# Altium project LimeKEY-RPCM_1v2.PrjPcb (part 8 of 8)

## Sheet 13_Temp.SchDoc: Power
size A3; Organization: Lime Microsystems; Address1: Surrey Tech Centre; Address2: Guildford GU2 7YG; Address3: Surrey; Address4: United Kingdom; Revision: v1.1; SheetNumber: 12; SheetTotal: 12
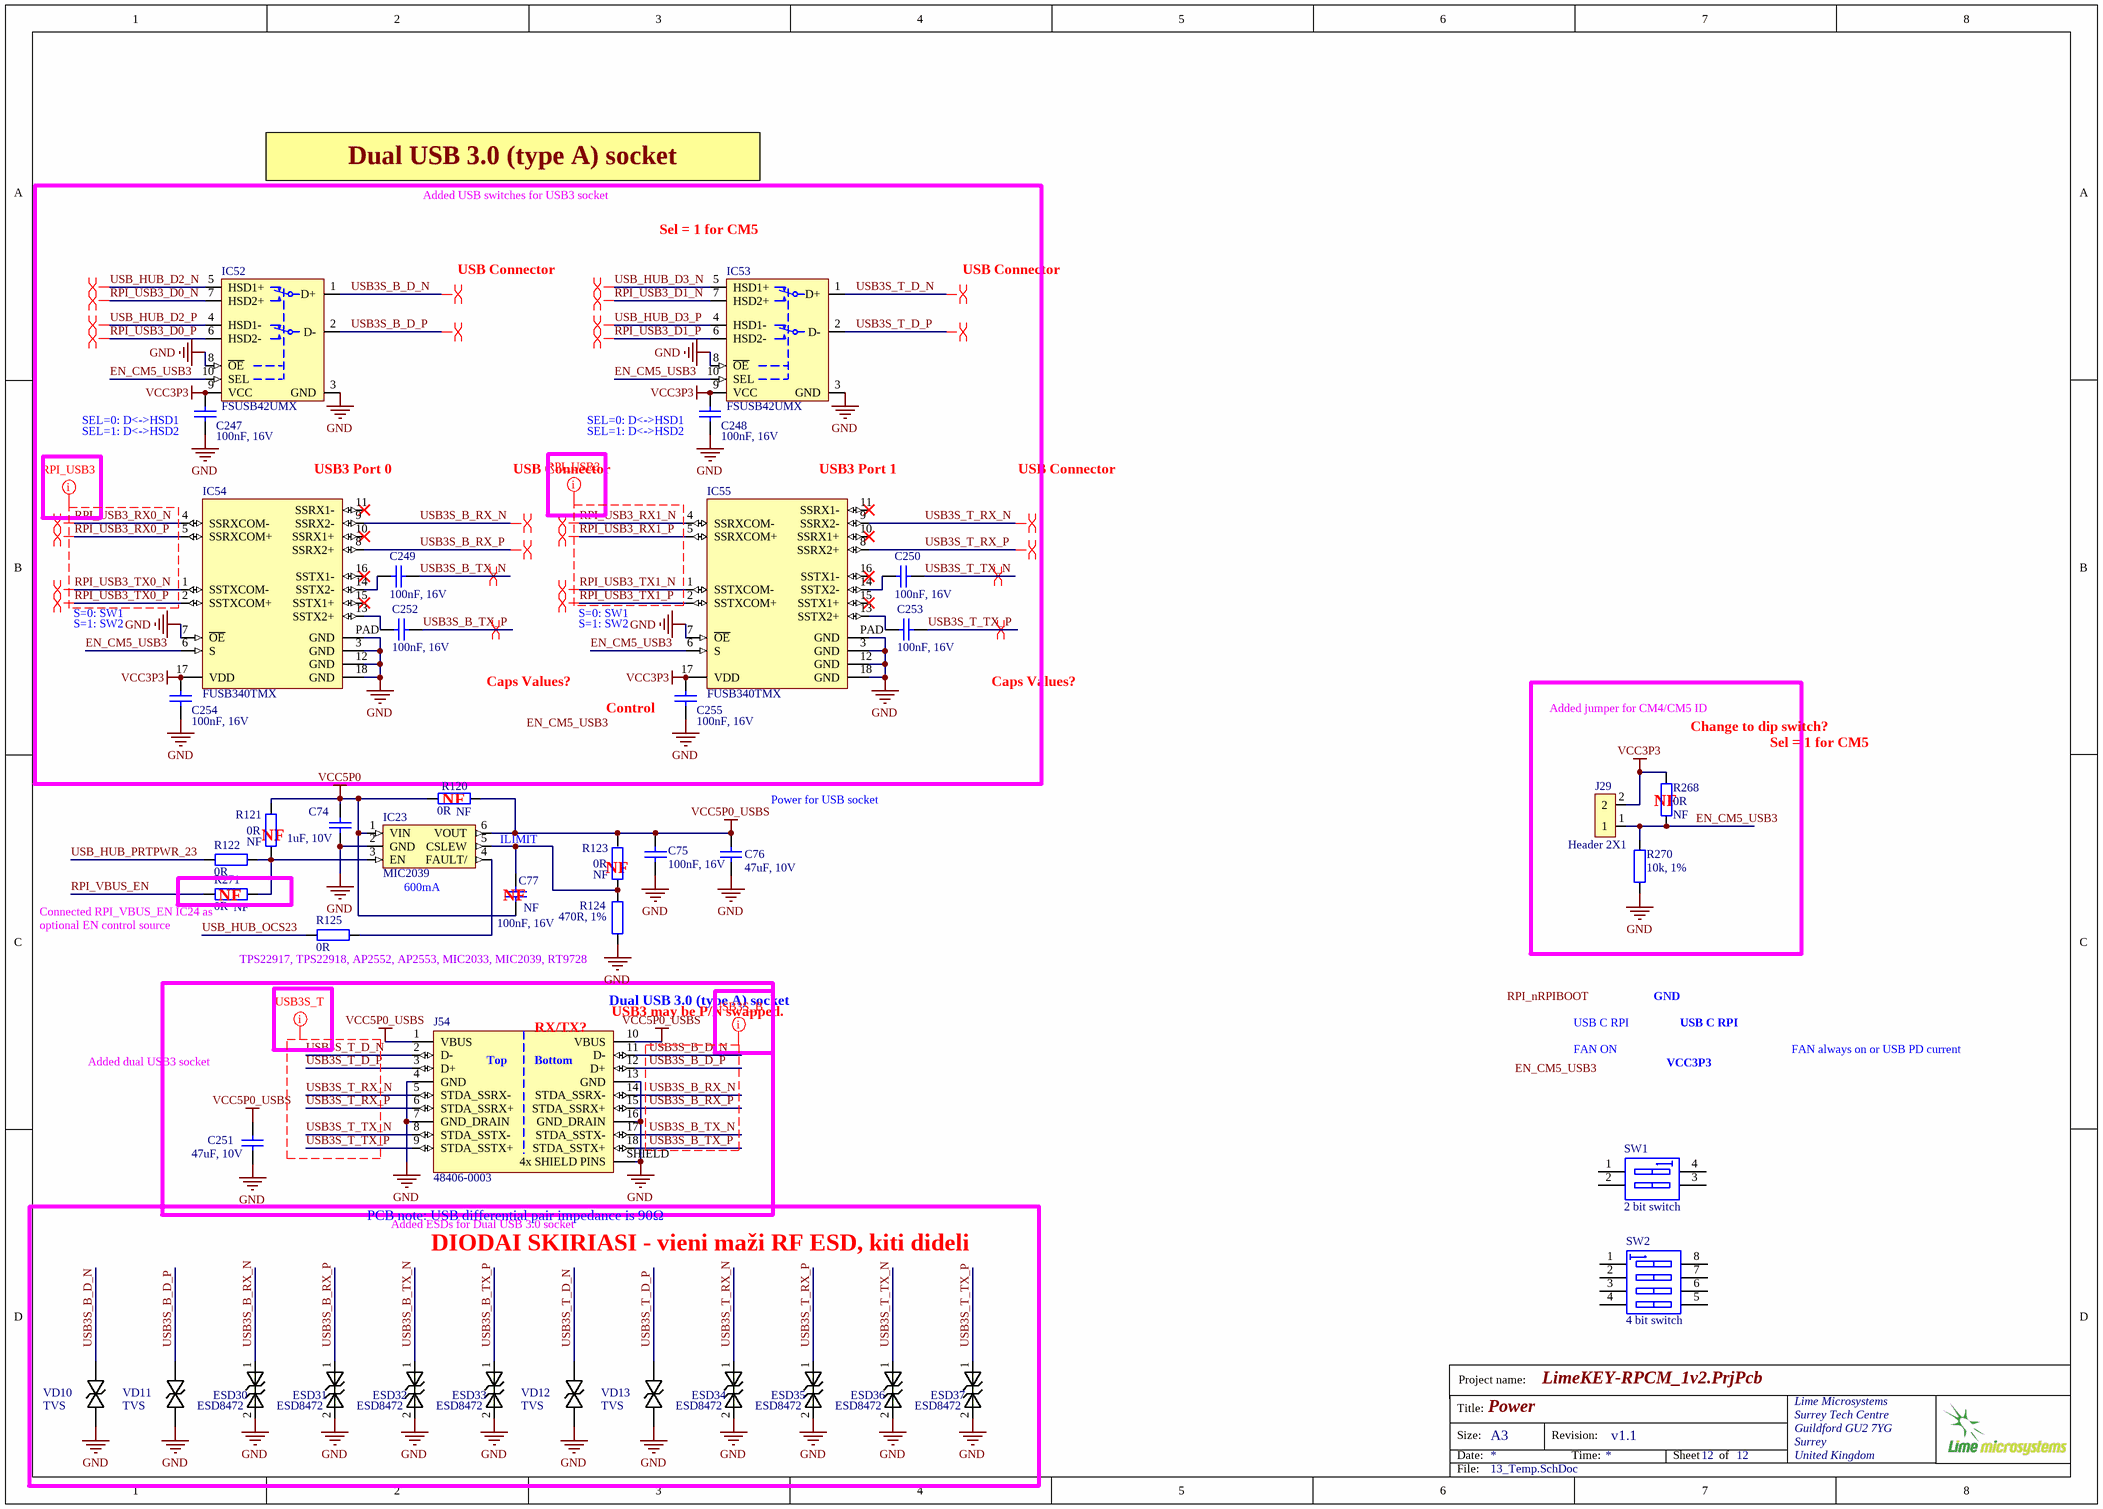
[diagram p10: 13_Temp.SchDoc]

### Parts
(Parts that share a designator on the sheet are numbered #1, #2 ... from top to bottom, then left to right.)
C74  1uF, 10V  [CAP0402]
C75  100nF, 16V  [CAP0402]
C76  47uF, 10V  [CAP1206]
C77  100nF, 16V  Assembly Info: NF  [CAP0402]
C247  100nF, 16V  [CAP0402]
C248  100nF, 16V  [CAP0402]
C249  100nF, 16V  [CAP0402]
C250  100nF, 16V  [CAP0402]
C251  47uF, 10V  [CAP1206]
C252  100nF, 16V  [CAP0402]
C253  100nF, 16V  [CAP0402]
C254  100nF, 16V  [CAP0402]
C255  100nF, 16V  [CAP0402]
ESD30  ESD8472  [ESD8472_X3DFN2]
ESD31  ESD8472  [ESD8472_X3DFN2]
ESD32  ESD8472  [ESD8472_X3DFN2]
ESD33  ESD8472  [ESD8472_X3DFN2]
ESD34  ESD8472  [ESD8472_X3DFN2]
ESD35  ESD8472  [ESD8472_X3DFN2]
ESD36  ESD8472  [ESD8472_X3DFN2]
ESD37  ESD8472  [ESD8472_X3DFN2]
IC23  MIC2039  [SOT23-6]
IC52  FSUSB42UMX  [FSUSB42UMX]
IC53  FSUSB42UMX  [FSUSB42UMX]
IC54  FUSB340TMX  [FUSB340TMX_USB_switch_18-XFQFN]
IC55  FUSB340TMX  [FUSB340TMX_USB_switch_18-XFQFN]
J29  Header 2X1  [HDR_1x2]
J54  48406-0003  [Dual_USB_48406-0003_Molex]
R120  0R  Assembly Info: NF  [RES0402]
R121  0R  Assembly Info: NF  [RES0402]
R122  0R  [RES0402]
R123  0R  Assembly Info: NF  [RES0402]
R124  470R, 1%  [RES0402]
R125  0R  [RES0402]
R268  0R  Assembly Info: NF  [RES0402]
R270  10k, 1%  [RES0402]
R271  0R  Assembly Info: NF  [RES0402]
SW1#2  2 bit switch  [SW_2WAY_SMD_1P27]
SW2  4 bit switch  [SW_4WAY_SMD_1P27]
VD10  TVS  [SOD323]
VD11  TVS  [SOD323]
VD12  TVS  [SOD323]
VD13  TVS  [SOD323]

### Blocks framed on the sheet
PCB note: USB differential pair impedance is 90Ω: ESD30-ESD37 VD10-VD13

### Nets
GND: C74.2 C75.2 C76.1 C247.2 C248.2 C251.1 C254.2 C255.2 ESD30.2 ESD31.2 ESD32.2 ESD33.2 ESD34.2 ESD35.2 ESD36.2 ESD37.2 IC23.2(GND) IC52.3(GND) IC52.8(~{OE}) IC53.3(GND) IC53.8(~{OE}) IC54.3(GND) IC54.7(~{OE}) IC54.12(GND) IC54.18(GND) IC54.PAD(GND) IC55.3(GND) IC55.7(~{OE}) IC55.12(GND) IC55.18(GND) IC55.PAD(GND) J54.4(GND) J54.7(GND_DRAIN) J54.13(GND) J54.16(GND_DRAIN) J54.SHIELD(4x_SHIELD_PINS) R124.1 R270.2 VD10.K VD11.K VD12.K VD13.K
VCC3P3: C247.1 C248.1 C254.1 C255.1 IC52.9(VCC) IC53.9(VCC) IC54.17(VDD) IC55.17(VDD) J29.2 R268.2
VCC5P0: C74.1 C77.2 IC23.1(VIN) R120.2 R121.2
VCC5P0_USBS: C75.1 C76.2 C251.2 IC23.6(VOUT) J54.1(VBUS) J54.10(VBUS) R120.1 R123.2
EN_CM5_USB3: IC52.10(SEL) IC53.10(SEL) IC54.6(S) IC55.6(S) J29.1 R268.1 R270.1
RPI_USB3_D0_N: IC52.7(HSD2+)
RPI_USB3_D0_P: IC52.6(HSD2-)
RPI_USB3_D1_N: IC53.7(HSD2+)
RPI_USB3_D1_P: IC53.6(HSD2-)
RPI_USB3_RX0_N: IC54.4(SSRXCOM-)
RPI_USB3_RX0_P: IC54.5(SSRXCOM+)
RPI_USB3_RX1_N: IC55.4(SSRXCOM-)
RPI_USB3_RX1_P: IC55.5(SSRXCOM+)
RPI_USB3_TX0_N: IC54.1(SSTXCOM-)
RPI_USB3_TX0_P: IC54.2(SSTXCOM+)
RPI_USB3_TX1_N: IC55.1(SSTXCOM-)
RPI_USB3_TX1_P: IC55.2(SSTXCOM+)
RPI_VBUS_EN: R271.2
USB3S_B_D_N: IC52.1(D+) J54.11(D-) VD10.A
USB3S_B_D_P: IC52.2(D-) J54.12(D+) VD11.A
USB3S_B_RX_N: ESD30.1 IC54.9(SSRX2-) J54.14(STDA_SSRX-)
USB3S_B_RX_P: ESD31.1 IC54.8(SSRX2+) J54.15(STDA_SSRX+)
USB3S_B_TX_N: C249.2 ESD32.1 J54.17(STDA_SSTX-)
USB3S_B_TX_P: C252.2 ESD33.1 J54.18(STDA_SSTX+)
USB3S_T_D_N: IC53.1(D+) J54.2(D-) VD12.A
USB3S_T_D_P: IC53.2(D-) J54.3(D+) VD13.A
USB3S_T_RX_N: ESD34.1 IC55.9(SSRX2-) J54.5(STDA_SSRX-)
USB3S_T_RX_P: ESD35.1 IC55.8(SSRX2+) J54.6(STDA_SSRX+)
USB3S_T_TX_N: C250.2 ESD36.1 J54.8(STDA_SSTX-)
USB3S_T_TX_P: C253.2 ESD37.1 J54.9(STDA_SSTX+)
USB_HUB_D2_N: IC52.5(HSD1+)
USB_HUB_D2_P: IC52.4(HSD1-)
USB_HUB_D3_N: IC53.5(HSD1+)
USB_HUB_D3_P: IC53.4(HSD1-)
USB_HUB_OCS23: R125.2
USB_HUB_PRTPWR_23: R122.2
NetC77_1: C77.1 IC23.5(CSLEW) R123.1 R124.2
NetC249_1: C249.1 IC54.14(SSTX2-)
NetC250_1: C250.1 IC55.14(SSTX2-)
NetC252_1: C252.1 IC54.13(SSTX2+)
NetC253_1: C253.1 IC55.13(SSTX2+)
NetIC23_3: IC23.3(EN) R121.1 R122.1 R271.1
NetIC23_4: IC23.4(FAULT/) R125.1

Not connected (* = marked no-connect by the designer): IC54 10(SSRX1+)* 11(SSRX1-)* 15(SSTX1+)* 16(SSTX1-)*; IC55 10(SSRX1+)* 11(SSRX1-)* 15(SSTX1+)* 16(SSTX1-)*; SW1#2 1(A1) 2(A2) 3(B2) 4(B1); SW2 1(A1) 2(A2) 3(A3) 4(A4) 5(B4) 6(B3) 7(B2) 8(B1)

### Layout directives
differential pair: RPI_USB3_D0_N, RPI_USB3_D0_P, RPI_USB3_D1_N, RPI_USB3_D1_P, RPI_USB3_RX0_N, RPI_USB3_RX0_P, RPI_USB3_RX1_N, RPI_USB3_RX1_P, RPI_USB3_TX0_N, RPI_USB3_TX0_P, RPI_USB3_TX1_N, RPI_USB3_TX1_P, USB3S_B_D_N, USB3S_B_D_P, USB3S_B_RX_N, USB3S_B_RX_P, USB3S_B_TX_N, USB3S_B_TX_P, USB3S_T_D_N, USB3S_T_D_P, USB3S_T_RX_N, USB3S_T_RX_P, USB3S_T_TX_N, USB3S_T_TX_P, USB_HUB_D2_N, USB_HUB_D2_P, USB_HUB_D3_N, USB_HUB_D3_P
net class RPI_USB3: RPI_USB3_RX0_N, RPI_USB3_RX0_P, RPI_USB3_RX1_N, RPI_USB3_RX1_P, RPI_USB3_TX0_N, RPI_USB3_TX0_P, RPI_USB3_TX1_N, RPI_USB3_TX1_P
net class USB3S_T: USB3S_T_D_N, USB3S_T_D_P, USB3S_T_RX_N, USB3S_T_RX_P, USB3S_T_TX_N, USB3S_T_TX_P
net class USB3S_B: USB3S_B_D_N, USB3S_B_D_P, USB3S_B_RX_N, USB3S_B_RX_P, USB3S_B_TX_N, USB3S_B_TX_P

### Notes on the sheet
- Dual USB 3.0 (type A) socket
- Added USB switches for USB3 socket
- Sel = 1 for CM5
- (near IC52) USB Connector
- (near IC53) USB Connector
- (near C247) SEL=0: D<->HSD1
- (near C247) SEL=1: D<->HSD2
- (near C248) SEL=0: D<->HSD1
- (near C248) SEL=1: D<->HSD2
- USB3 Port 0
- USB Connector
- USB3 Port 1
- S=0: SW1
- S=1: SW2
- Caps Values?
- Control
- Added jumper for CM4/CM5 ID
- Change to dip switch?
- (near R268) Sel = 1 for CM5
- (near R121) NF
- (near R120) NF
- ILIMIT
- Power for USB socket
- (near R268) NF
- (near R271) NF
- (near IC23) 600mA
- (near C77) NF
- (near R123) NF
- (near R271) Connected RPI_VBUS_EN IC24 as optional EN control source
- TPS22917, TPS22918, AP2552, AP2553, MIC2033, MIC2039, RT9728
- (near J54) RX/TX?
- (near J54) Dual USB 3.0 (type A) socket
- (near J54) USB3 may be P/N swapped.
- USB C RPI
- FAN ON
- GND
- FAN always on or USB PD current
- (near J54) Added dual USB3 socket
- VCC3P3
- (near J54) Added ESDs for Dual USB 3.0 socket
- DIODAI SKIRIASI - vieni maži RF ESD, kiti dideli
- Labels drawn without touching a wire or pin: EN_CM5_USB3, RPI_nRPIBOOT
- Project name:
- Title:
- Size:
- Date:
- A3
- Revision:
- Time:
- Sheet
- of
- File:
- (in symbol Dual_USB_48406-0003_Molex) Top; Bottom

### Library data of the parts
C74 = Cap_0402: as C172-C175 on sheet 10_RFFE; Value: 1uF, 10V; Supplier 1: Digi-Key; Supplier Part Number 1: 311-1732-1-ND; MSL: -; RoHS: YES
C75 C77 = Cap_0402: as C138 on sheet 10_RFFE; Value: 100nF, 16V; Supplier 1: Mouser; Supplier Part Number 1: 81-GRM155R71C104KA88; Case Code - in: 0402; RoHS: RoHS Compliant; Operating Temperature Range: - 55 C to + 125 C; Series: GRM; Termination Style: SMD/SMT; Package / Case: 0402 (1005 metric); Voltage Rating DC: 16 V; Maximum Operating Temperature: + 125 C; Case Code - mm: 1005; Minimum Operating Temperature: - 55 C; Product Category: Low & Medium Capacitance SMD Ceramic Chip Capacitors; Packaging: Reel; Product: General Type MLCCs; Category: Multilayer Ceramic Capacitors MLCC - SMD/SMT; Brand: Murata Electronics; Case Width: 0.5 mm; RoHS - Mouser: Y; Standard Pack Qty: 10000; Minimum Order Quantity: 1; Reeling: True; Manufacturer Part Number: GRM155R71C104KA88D
C76 C251 = Cap_1206: Manufacturer: TDK Corporation; Manufacturer Part Number 1: C3216X6S1A476M160AC; Part Description: 47µF ±20% 10V Ceramic Capacitor X6S 1206 (3216 Metric); Notification: Current market demand for these product types have resulted in fluctuating and extending lead times. Lead times may differ.; Tolerance: ±20%; Temperature Coefficient: X6S; Value: 47uF, 10V; RoHS: RoHS Compliant; Packaging: Cut Tape (CT); Operating Temperature: -55°C ~ 105°C; Voltage - Rated: 10V; Height - Seated (Max): -; Ratings: -; Applications: General Purpose; Features: Low ESL; Size / Dimension: 0.126" L x 0.063" W (3.20mm x 1.60mm); Supplier 1: Digi-Key; Lead Spacing: -; Supplier Part Number 1: 445-6010-1-ND; Thickness (Max): 0.071" (1.80mm); Failure Rate: -; Category: Capacitors; Lead Style: -; Part Status: Active; Mounting Type: Surface Mount, MLCC; Package / Case: 1206 (3216 Metric)
C247-C250 C252-C255 = Cap_0402: Manufacturer: Murata Electronics; Manufacturer Part Number: GRM155R71C104KA88D; Part Description: 0.10µF ±10% 16V Ceramic Capacitor X7R 0402 (1005 Metric); Tolerance: 10 %; Type: General Purpose MLCC; Capacitance: 0.1 uF; Case Length: 1 mm; Dielectric: X7R; Case Height: 0.5 mm; Temperature Coefficient / Code: +/- 15 %; Value: 100nF, 16V; Supplier 1: Mouser; Supplier Part Number 1: 81-GRM155R71C104KA88; Case Code - in: 0402; RoHS: RoHS Compliant; Operating Temperature Range: - 55 C to + 125 C; Series: GRM; Termination Style: SMD/SMT; Package / Case: 0402 (1005 metric); Voltage Rating DC: 16 V; Maximum Operating Temperature: + 125 C; Case Code - mm: 1005; Minimum Operating Temperature: - 55 C; Product Category: Low & Medium Capacitance SMD Ceramic Chip Capacitors; Packaging: Reel; Product: General Type MLCCs; Category: Multilayer Ceramic Capacitors MLCC - SMD/SMT; Brand: Murata Electronics; Case Width: 0.5 mm; RoHS - Mouser: Y; Standard Pack Qty: 10000; Minimum Order Quantity: 1; Reeling: True; Manufacturer Part Number 1: GRM155R71C104KA88D
ESD30-ESD37 = ESD8472: as ESD1#2 on sheet 10_RFFE; Supplier 1: Digi-Key; RoHS: RoHS Compliant; Category: Circuit Protection; Stock 1: 2295; Pricing 1: 1=0.39, 10=0.315, 100=0.2142, 500=0.16068, 1000=0.12051 (USD); Packaging: Cut Tape (CT); Part Status: Active; Type: Zener; Power - Peak Pulse: -; Applications: Automotive, RF Antenna; Operating Temperature: -55°C ~ 150°C (TJ); Mounting Type: Surface Mount; Package / Case: 2-XFDFN; Supplier Device Package: 2-X3DFN (0.62x0.32); ComponentLink1URL: http://www.onsemi.com/pub/Collateral/ESD8472-D.PDF; ComponentLink1Description: http://www.onsemi.com/pub/Collateral/ESD8472-D.PDF; Supplier Part Number 1: ESD8472MUT5GOSCT-ND
IC23 = MIC2033_power_switch: as IC38-IC41 on sheet 10_RFFE; ComponentLink1URL: http://www.mouser.com/ds/2/268/mic2033-b-1076865.pdf?src-supplier=Mouser; ComponentLink1Description: http://www.mouser.com/ds/2/268/mic2033-b-1076865.pdf?src-supplier=Mouser; ComponentLink2URL: http://components.arrow.com/part/dataview/56727820S413982N1374?src-supplier=Arrow+Electronics; ComponentLink2Description: http://components.arrow.com/part/dataview/56727820S413982N1374?src-supplier=Arrow+Electronics; ComponentLink3URL: http://www.microchip.com/mymicrochip/filehandler.aspx?ddocname=en579457&src-supplier=Digi-Key; ComponentLink3Description: http://www.microchip.com/mymicrochip/filehandler.aspx?ddocname=en579457&src-supplier=Digi-Key; Supplier 1: Digi-Key; Supplier Part Number 1: 576-4193-1-ND; Stock 1: 37195; Pricing 1: 1=0,98000, 25=0,80560, 100=0,75000 (USD); RoHS: No; Case/Package: SOT-23-6; Min Operating Temperature: -40°C; Max Operating Temperature: 125°C; Package Quantity: 3000; Packaging: Tape and Reel; Series: -; ComponentLink4URL: https://datasheet.ciiva.com/6607/mic2039-6607725.pdf?src-supplier=Digi-Key; ComponentLink4Description: https://datasheet.ciiva.com/6607/mic2039-6607725.pdf?src-supplier=Digi-Key
IC52 IC53 = FSUSB42UMX: Part Description: USB Switch IC 1 Channel 10-UMLP (1.8x1.4); Manufacturer: ON Semiconductor; Switch Circuit: DPDT; On-State Resistance (Max): 6.5 Ohm; Voltage - Supply, Single (V+): 2.4 V ~ 4.4 V; -3db Bandwidth: 720MHz; Supplier 1: Digi-Key; Manufacturer Part Number 1: FSUSB42UMX; RoHS: RoHS Compliant; Category: Integrated Circuits (ICs); Stock 1: 8344; Pricing 1: 1=0.59, 10=0.502, 100=0.3749, 500=0.29458, 1000=0.22763 (USD); Packaging: Cut Tape (CT); Part Status: Active; Applications: USB; Multiplexer/Demultiplexer Circuit: -; Voltage - Supply, Dual (V±): -; Features: Break-Before-Make, USB 2.0; Operating Temperature: -40°C ~ 85°C (TA); Package / Case: 10-UFQFN; Supplier Device Package: 10-UMLP (1.8x1.4); Base Part Number: FSUSB42; ComponentLink1URL: https://www.fairchildsemi.com/datasheets/FS/FSUSB42.pdf; ComponentLink1Description: https://www.fairchildsemi.com/datasheets/FS/FSUSB42.pdf; Supplier Part Number 1: FSUSB42UMXCT-ND
IC54 IC55 = FUSB340TMX_USB_switch: Part Description: USB Switch USB 3.1 USB Interface 18-TMLP (2x2.8); Manufacturer: ON Semiconductor / Fairchild; Interface: USB; Operating Supply Current: 12uA; Number of Switches: 4; Data Rate: 10Gbps; Max Supply Voltage: 5V; Min Supply Voltage: 1.5V; Supplier 1: Digikey; Supplier Part Number 1: FUSB340TMXCT-ND; Manufacturer Part Number 1: FUSB340TMX; Stock 1: 7942; Pricing 1: 1=1,15, 10=1,026, 25=0,9744, 100=0,7481, 250=0,66108, 500=0,6263, 1000=0,48712, 2500=0,46277 (USD); RoHS: Yes; Mount: Surface Mount; Number of Pins: 18; Weight: 0.0065g; Min Operating Temperature: -40°C; Max Operating Temperature: 85°C; Packaging: Cut Tape; Series: -; Nominal Supply Current: 12uA; Height: 400um; RoHS Compliant: Yes; ComponentLink1URL: http://www.farnell.com/datasheets/2313412.pdf?src-supplier=Farnell; ComponentLink1Description: http://www.farnell.com/datasheets/2313412.pdf?src-supplier=Farnell; ComponentLink2URL: http://www.farnell.com/datasheets/2313412.pdf?src-supplier=Newark; ComponentLink2Description: http://www.farnell.com/datasheets/2313412.pdf?src-supplier=Newark; ComponentLink3URL: https://datasheet.octopart.com/FUSB340TMX-ON-Semiconductor-datasheet-85553255.pdf?src-supplier=Farnell; ComponentLink3Description: https://datasheet.octopart.com/FUSB340TMX-ON-Semiconductor-datasheet-85553255.pdf?src-supplier=Farnell; ComponentLink4URL: https://datasheet.octopart.com/FUSB340TMX-ON-Semiconductor-datasheet-46935021.pdf?src-supplier=Future+Electronics; ComponentLink4Description: https://datasheet.octopart.com/FUSB340TMX-ON-Semiconductor-datasheet-46935021.pdf?src-supplier=Future+Electronics; ComponentLink5URL: https://www.fairchildsemi.com/Assets/-Featured-Collateral/Datasheet-Briefs/FUSB340_PB_Final.pdf?src-supplier=Avnet; ComponentLink5Description: https://www.fairchildsemi.com/Assets/-Featured-Collateral/Datasheet-Briefs/FUSB340_PB_Final.pdf?src-supplier=Avnet
J29 = Jumper: Manufacturer Part Number 1: 961102-6404-AR; Part Description: 2 Positions Header, Unshrouded Connector 0.100" (2.54mm) Through Hole Gold; Manufacturer: 3M; Connector Type: Header, Unshrouded; Supplier 1: Digi-Key; Supplier Part Number 1: 3M9447-ND; Contact Type: Male Pin; Color: Black; Mounting Type: Through Hole; Category: Connectors, Interconnects; Contact Finish: Gold
J54 = Dual_USB_48406-0003_Molex: Part Description: USB Connectors USB 3.0 F/A STD RA REC STACKED 15u'; Manufacturer: Molex; Manufacturer Part Number 1: 0484060003; Supplier 1: Mouser; Supplier Part Number 1: 538-48406-0003; Stock 1: 4086; Pricing 1: 1=2,69, 10=1,92, 50=1,92, 100=1,82, 1000=1,78, 10000=1,43 (USD); RoHS: Yes; ComponentLink1URL: https://datasheet.octopart.com/48406-0003-Molex-datasheet-33003502.pdf?src-supplier=Newark; ComponentLink1Description: https://datasheet.octopart.com/48406-0003-Molex-datasheet-33003502.pdf?src-supplier=Newark; ComponentLink2URL: https://datasheet.octopart.com/48406-0003-Molex-datasheet-101583044.pdf?src-supplier=Farnell; ComponentLink2Description: https://datasheet.octopart.com/48406-0003-Molex-datasheet-101583044.pdf?src-supplier=Farnell; ComponentLink3URL: https://www.molex.com/pdm_docs/sd/484060003_sd.pdf?src-supplier=Digikey; ComponentLink3Description: https://www.molex.com/pdm_docs/sd/484060003_sd.pdf?src-supplier=Digikey; ComponentLink4URL: https://datasheet.octopart.com/484060003-Molex-datasheet-168216735.pdf?src-supplier=TME; ComponentLink4Description: https://datasheet.octopart.com/484060003-Molex-datasheet-168216735.pdf?src-supplier=TME; ComponentLink5URL: https://datasheet.octopart.com/48406-0003-Molex-datasheet-21137617.pdf?src-supplier=Sager+Electronics; ComponentLink5Description: https://datasheet.octopart.com/48406-0003-Molex-datasheet-21137617.pdf?src-supplier=Sager+Electronics; ComponentLink6URL: https://datasheet.octopart.com/48406-0003-Molex-datasheet-154752298.pdf?src-supplier=Master+Electronics; ComponentLink6Description: https://datasheet.octopart.com/48406-0003-Molex-datasheet-154752298.pdf?src-supplier=Master+Electronics
R120-R123 R125 R268 R271 = Res_0402: as R171-R174 on sheet 10_RFFE; Value: 0R; Supplier 1: Digi-Key; Supplier Part Number 1: 311-0.0JRTR-ND; Category: Resistors; Temperature Coefficient: -; Features: Moisture Resistant; Supplier Device Package: 0402; Height: 0.016" (0.40mm); Package / Case: 0402 (1005 Metric); Operating Temperature: -55°C ~ 155°C; Size / Dimension: 0.039" L x 0.020" W (1.00mm x 0.50mm); Composition: Thick Film; Packaging: Tape & Reel (TR); Number of Terminations: 2; RoHS: RoHS Compliant
R124 = Res_0402: as R193-R196 on sheet 10_RFFE; Value: 470R, 1%; Supplier 1: Digi-Key; Supplier Part Number 1: 311-470LRCT-ND; Stock 1: 1652476; Pricing 1: 1=0,10000, 10=0,01600, 100=0,00660, 1000=0,00299, 2500=0,00259, 5000=0,00214 (USD); RoHS: Yes; Case/Package: 0402; Case Code (Metric): 1005; Case Code (Imperial): 0402; Size Code: 0402; Min Operating Temperature: -55°C; Max Operating Temperature: 155°C; Packaging: Tape and Reel; Tolerance: 1%; Resistance: 470R; Number of Terminations: 2; Features: Moisture Resistant; Package Quantity: 1; Resistor Type: Thick Film; Termination: SMD/SMT; Series: RC; Resistance Tolerance: 1%; Construction: Rectangular; Length: 1mm; Width: 0.02inch; Height: 0.016inch; Depth: 0.5mm; Lead Free: Lead Free; REACH SVHC: Unknown; Military Standard: Not; RoHS Compliant: Yes; Manufacturer: Yageo
R270 = Res_0402: as R189-R192 on sheet 10_RFFE; Value: 10k, 1%; Supplier 1: Digi-Key; Supplier Part Number 1: 311-10.0KLRTR-ND; Resistance (Ohms): 10k; Packaging: Tape & Reel (TR); RoHS: RoHS Compliant; Package / Case: 0402 (1005 Metric); Tolerance: ±1%; Operating Temperature: -55°C ~ 155°C; Size / Dimension: 0.039" L x 0.020" W (1.00mm x 0.50mm); Number of Terminations: 2; Category: Resistors; Height: 0.016" (0.40mm); Supplier Device Package: 0402; Features: Moisture Resistant; Composition: Thick Film
SW1#2 = SW_SM_2bit: Manufacturer: TE Connectivity Alcoswitch Switches; Manufacturer Part Number 1: 1571983-1; Circuit: SPST; Voltage Rating: 24VDC; Mechanical Life: 1,000 Cycles; Current Rating: 25mA; Actuator Level: Flush, Recessed; Pitch: 0.050" (1.27mm), Half; Actuator Type: Slide (Standard); Body Material: Polyphenylene Sulfide (PPS); Number of Positions: 2; Washable: Yes; Supplier 1: Digi-Key; Features: Tape Seal; Termination Style: Gull Wing; Category: Switches; Electrical Life: 1,000 Cycles; Length: 0.144" (3.67mm); Contact Finish: Gold; Packaging: Tube; Operating Temperature: -30°C ~ 85°C; RoHS: RoHS Compliant; Contact Material: Copper Alloy; Height Above Board: 0.091" (2.30mm); Mounting Type: Surface Mount; Supplier Part Number 1: 450-1431-ND
SW2 = SW_SM_4bit: Manufacturer Part Number 1: A6H-4101; Manufacturer: Omron Electronics Inc-EMC Div; Pitch: 0.050" (1.27mm), Half; Mechanical Life: 1,000 Cycles; Washable: No; Current Rating: 25mA; Number of Positions: 4; Voltage Rating: 24VDC; Actuator Level: Flush, Recessed; Circuit: SPST; Actuator Type: Slide (Standard); Supplier 1: Digi-Key; Height Above Board: 0.061" (1.55mm); RoHS: RoHS Compliant; Termination Style: Gull Wing; Electrical Life: 1,000 Cycles; Length: 0.248" (6.31mm); Category: Switches; Operating Temperature: -20°C ~ 70°C; Body Material: -; Contact Material: -; Features: -; Mounting Type: Surface Mount; Contact Finish: -; Packaging: Tube; Supplier Part Number 1: SW1080-ND
VD10-VD13 = DIODE_TVS: Manufacturer 1: Sangdest Microelectronics; Manufacturer Part Number: SD03LCC; Part Description: 19V Clamp 20A (8/20µs) Ipp Tvs Diode Surface Mount SOD-323; ComponentLink1URL: https://datasheet.ciiva.com/29588/littelfuse-tvs-diode-array-sp4020-datasheet-pdf-29588193.pdf?src-supplier=Digi-Key; ComponentLink1Description: https://datasheet.ciiva.com/29588/littelfuse-tvs-diode-array-sp4020-datasheet-pdf-29588193.pdf?src-supplier=Digi-Key; ComponentLink2URL: https://datasheet.ciiva.com/24111/littelfuse-sp4020-267385-24111169.pdf?src-supplier=Mouser; ComponentLink2Description: https://datasheet.ciiva.com/24111/littelfuse-sp4020-267385-24111169.pdf?src-supplier=Mouser; Supplier 1: Digi-Key; Supplier Part Number 1: 1655-SD03LCCCT-ND; Stock 1: 8808; Pricing 1: 1=0,37000, 10=0,27300, 100=0,15460, 500=0,10240, 1000=0,07851 (USD); RoHS: No; Manufacturer: Sangdest Microelectronics; Manufacturer Part Number 1: SD03LCC

## Nets that join several sheets
GND: 05_RPi_mPCIe (82 pins), 06_Misc_1 (74 pins), 07_Misc_2 (72 pins), 08_USB (61 pins), 09_Clock (80 pins), 10_RFFE (142 pins), 13_Temp (42 pins)
VCC2P5_VREF: 07_Misc_2 (R48.1), 09_Clock (R152.2)
VCC3P3: 05_RPi_mPCIe (9 pins), 06_Misc_1 (35 pins), 07_Misc_2 (35 pins), 08_USB (28 pins), 09_Clock (C246.1 IC56.9), 13_Temp (10 pins)
VCC5P0: 05_RPi_mPCIe (8 pins), 06_Misc_1 (6 pins), 07_Misc_2 (6 pins), 08_USB (8 pins), 10_RFFE (FR9.1 FR10.1), 13_Temp (5 pins)
ADF_MUXOUT: 05_RPi_mPCIe (J1.56), 09_Clock (IC28.15 R159.1)
BUZZER: 05_RPi_mPCIe (J1.34), 06_Misc_1 (R28.1 R31.1 VT1.G)
CAM1_CLK_N: 05_RPi_mPCIe (J2.27), 06_Misc_1 (J16.8)
CAM1_CLK_P: 05_RPi_mPCIe (J2.29), 06_Misc_1 (J16.9)
CAM1_D0_N: 05_RPi_mPCIe (J2.15), 06_Misc_1 (J16.2)
CAM1_D0_P: 05_RPi_mPCIe (J2.17), 06_Misc_1 (J16.3)
CAM1_D1_N: 05_RPi_mPCIe (J2.21), 06_Misc_1 (J16.5)
CAM1_D1_P: 05_RPi_mPCIe (J2.23), 06_Misc_1 (J16.6)
CAM1_GPIO0: 05_RPi_mPCIe (J1.97), 06_Misc_1 (J16.11)
DSI1_CLK_N: 05_RPi_mPCIe (J2.87), 06_Misc_1 (J15.5)
DSI1_CLK_P: 05_RPi_mPCIe (J2.89), 06_Misc_1 (J15.6)
DSI1_D0_N: 05_RPi_mPCIe (J2.75), 06_Misc_1 (J15.8)
DSI1_D0_P: 05_RPi_mPCIe (J2.77), 06_Misc_1 (J15.9)
DSI1_D1_N: 05_RPi_mPCIe (J2.81), 06_Misc_1 (J15.2)
DSI1_D1_P: 05_RPi_mPCIe (J2.83), 06_Misc_1 (J15.3)
EN_CM5_USB3: 05_RPi_mPCIe (IC1.6), 06_Misc_1 (SW1#1.4), 13_Temp (7 pins)
EN_RXA_LNA: 07_Misc_2 (IC17.1), 10_RFFE (IC41.3 R178.2 R188.1)
EN_RXB_LNA: 07_Misc_2 (IC17.3), 10_RFFE (IC39.3 R176.2 R186.1)
EN_TXA_PA: 07_Misc_2 (IC17.15), 10_RFFE (IC40.3 R177.2 R187.1)
EN_TXB_PA: 07_Misc_2 (IC17.2), 10_RFFE (IC38.3 R175.2 R185.1)
ETH_LED_G: 05_RPi_mPCIe (J1.17), 06_Misc_1 (R29.2)
ETH_LED_Y: 05_RPi_mPCIe (J1.15), 06_Misc_1 (R30.2)
ETH_TRD0_N: 05_RPi_mPCIe (J1.10), 06_Misc_1 (J9.2 VD2.A)
ETH_TRD0_P: 05_RPi_mPCIe (J1.12), 06_Misc_1 (J9.1 VD1.A)
ETH_TRD1_N: 05_RPi_mPCIe (J1.6), 06_Misc_1 (J9.6 VD4.A)
ETH_TRD1_P: 05_RPi_mPCIe (J1.4), 06_Misc_1 (J9.3 VD3.A)
ETH_TRD2_N: 05_RPi_mPCIe (J1.9), 06_Misc_1 (J9.8 VD6.A)
ETH_TRD2_P: 05_RPi_mPCIe (J1.11), 06_Misc_1 (J9.7 VD5.A)
ETH_TRD3_N: 05_RPi_mPCIe (J1.5), 06_Misc_1 (J9.10 VD8.A)
ETH_TRD3_P: 05_RPi_mPCIe (J1.3), 06_Misc_1 (J9.9 VD7.A)
PCIE_COEX1: 05_RPi_mPCIe (J3.3), 09_Clock (R141.2)
PCIE_PPS_IN: 05_RPi_mPCIe (R2.2 R4.2), 09_Clock (J37.2 R141.1)
PCIE_PPS_OUT: 05_RPi_mPCIe (R3.2 R8.2), 09_Clock (J34.3 J38.1)
PCIE_UIM8: 05_RPi_mPCIe (J3.17), 07_Misc_2 (R39.2)
PCIE_UIMC4: 05_RPi_mPCIe (J3.19), 09_Clock (J39.2)
PCIE_USB_N: 05_RPi_mPCIe (J3.36), 08_USB (R97.1 R262.2)
PCIE_USB_P: 05_RPi_mPCIe (J3.38), 08_USB (R94#2.1 R261.2)
PTP_SYNC_SEL: 07_Misc_2 (IC17.6), 09_Clock (IC56.10 R269.1)
RF_SW_TDD: 07_Misc_2 (J19.2 R39.1 R40.1 R42.1), 10_RFFE (8 pins)
RPI_AIP0: 05_RPi_mPCIe (J1.96), 06_Misc_1 (J12.5)
RPI_AIP1: 05_RPi_mPCIe (J1.94), 06_Misc_1 (J12.6)
RPI_BTN1: 05_RPi_mPCIe (J1.45), 06_Misc_1 (BTN1.1 C25.1 R27.2)
RPI_BTN2: 05_RPi_mPCIe (J1.47), 06_Misc_1 (C12.1 J8.5 R13.2)
RPI_EEPROM_nWP: 05_RPi_mPCIe (J1.20), 06_Misc_1 (J12.4 R32.2)
RPI_GLOBAL_EN: 05_RPi_mPCIe (J1.99 J5.1), 06_Misc_1 (J12.14), 07_Misc_2 (R93.1)
RPI_GPIO2: 05_RPi_mPCIe (J1.58), 06_Misc_1 (J10.15)
RPI_GPIO4: 05_RPi_mPCIe (J1.54), 06_Misc_1 (J10.16)
RPI_GPIO22: 05_RPi_mPCIe (J1.46), 06_Misc_1 (J10.3)
RPI_GPIO27: 05_RPi_mPCIe (J1.48), 06_Misc_1 (J10.5)
RPI_I2C0_SCL: 05_RPi_mPCIe (J1.80 R10.2), 06_Misc_1 (J15.11 J16.13), 07_Misc_2 (9 pins), 08_USB (R119.2)
RPI_I2C0_SDA: 05_RPi_mPCIe (J1.82 R11.2), 06_Misc_1 (J15.12 J16.14), 07_Misc_2 (9 pins), 08_USB (R118.2)
RPI_ID_SC: 05_RPi_mPCIe (J1.35), 06_Misc_1 (J8.3 J10.18 R18.1)
RPI_ID_SD: 05_RPi_mPCIe (J1.36), 06_Misc_1 (J8.4 J10.17 R14.1)
RPI_LED_nPWR: 05_RPi_mPCIe (J1.95), 06_Misc_1 (IC3.2 R12.2 R15.2)
RPI_nEXTRST: 05_RPi_mPCIe (J1.100), 08_USB (R99.2)
RPI_nRPIBOOT: 05_RPi_mPCIe (J1.93), 06_Misc_1 (J12.2 SW1#1.1)
RPI_PIN11: 05_RPi_mPCIe (IC1.4 J2.11), 06_Misc_1 (J12.11)
RPI_PIN16: 05_RPi_mPCIe (J1.16), 09_Clock (IC56.2 R258.2)
RPI_PIN18: 05_RPi_mPCIe (J1.18), 09_Clock (IC56.1 R272.2)
RPI_PWM0: 05_RPi_mPCIe (J1.31), 06_Misc_1 (IC7.3)
RPI_PWM1: 05_RPi_mPCIe (J1.28), 06_Misc_1 (IC7.1)
RPI_RF_SW_TDD: 05_RPi_mPCIe (J1.30), 07_Misc_2 (R40.2)
RPI_RUN_PG: 05_RPi_mPCIe (J1.92 J5.3), 06_Misc_1 (IC5.2 J12.10 R21.2)
RPI_SD_CLK: 05_RPi_mPCIe (J1.57), 06_Misc_1 (J7.5)
RPI_SD_CMD: 05_RPi_mPCIe (J1.62), 06_Misc_1 (J7.3)
RPI_SD_D0: 05_RPi_mPCIe (J1.63), 06_Misc_1 (J7.7)
RPI_SD_D1: 05_RPi_mPCIe (J1.67), 06_Misc_1 (J7.8)
RPI_SD_D2: 05_RPi_mPCIe (J1.69), 06_Misc_1 (J7.1)
RPI_SD_D3: 05_RPi_mPCIe (J1.61), 06_Misc_1 (J7.2)
RPI_SD_PWR_ON: 05_RPi_mPCIe (J1.75), 06_Misc_1 (IC6.3 R22.1)
RPI_SPI0_MISO: 05_RPi_mPCIe (J1.40), 06_Misc_1 (J10.11)
RPI_SPI0_MOSI: 05_RPi_mPCIe (J1.44), 06_Misc_1 (J10.9), 09_Clock (R165.1 R170.2)
RPI_SPI0_SCLK: 05_RPi_mPCIe (J1.38), 06_Misc_1 (J10.13), 09_Clock (R163.1 R169.2)
RPI_SPI0_SS0: 05_RPi_mPCIe (J1.39), 09_Clock (R168.2)
RPI_SPI0_SS1: 05_RPi_mPCIe (J1.37), 09_Clock (R166.1)
RPI_SPI1_MISO: 05_RPi_mPCIe (J1.26), 07_Misc_2 (IC8.12)
RPI_SPI1_MOSI: 05_RPi_mPCIe (J1.27), 07_Misc_2 (IC8.11 IC15.14)
RPI_SPI1_SCLK: 05_RPi_mPCIe (J1.25), 07_Misc_2 (IC8.13 IC15.11 IC17.11)
RPI_SPI1_SS0: 05_RPi_mPCIe (J1.49), 07_Misc_2 (IC8.10)
RPI_SPI1_SS1: 05_RPi_mPCIe (J1.50), 07_Misc_2 (IC15.12 IC17.12)
RPI_STATUS_LED_G: 06_Misc_1 (IC3.4 R15.1), 07_Misc_2 (R87.1 R94#1.2)
RPI_STATUS_LED_R: 05_RPi_mPCIe (J1.21), 07_Misc_2 (R89.1)
RPI_SYNC_IN: 06_Misc_1 (IC4.4 J12.8 R23.1), 09_Clock (J38.2)
RPI_SYNC_IN_LS: 06_Misc_1 (IC4.3 R23.2), 09_Clock (IC56.4 IC56.7 R258.1)
RPI_SYNC_OUT: 06_Misc_1 (IC2.4 J12.9 R16.1), 09_Clock (J34.5 J36.1 J37.1)
RPI_SYNC_OUT_LS: 06_Misc_1 (IC2.3 R16.2), 09_Clock (IC56.5 R272.1)
RPI_TVDAC: 05_RPi_mPCIe (IC1.3), 06_Misc_1 (J14.1 J17.4)
RPI_UART0_RX: 05_RPi_mPCIe (J1.51), 06_Misc_1 (J10.10 J11.3)
RPI_UART0_TX: 05_RPi_mPCIe (J1.55), 06_Misc_1 (J10.8 J11.2)
RPI_USB3_D0_N: 05_RPi_mPCIe (J2.36), 13_Temp (IC52.7)
RPI_USB3_D0_P: 05_RPi_mPCIe (J2.34), 13_Temp (IC52.6)
RPI_USB3_D1_N: 05_RPi_mPCIe (J2.65), 13_Temp (IC53.7)
RPI_USB3_D1_P: 05_RPi_mPCIe (J2.63), 13_Temp (IC53.6)
RPI_USB3_RX0_N: 05_RPi_mPCIe (J2.28), 13_Temp (IC54.4)
RPI_USB3_RX0_P: 05_RPi_mPCIe (J2.30), 13_Temp (IC54.5)
RPI_USB3_RX1_N: 05_RPi_mPCIe (J2.57), 13_Temp (IC55.4)
RPI_USB3_RX1_P: 05_RPi_mPCIe (J2.59), 13_Temp (IC55.5)
RPI_USB3_TX0_N: 05_RPi_mPCIe (J2.40), 13_Temp (IC54.1)
RPI_USB3_TX0_P: 05_RPi_mPCIe (J2.42), 13_Temp (IC54.2)
RPI_USB3_TX1_N: 05_RPi_mPCIe (J2.69), 13_Temp (IC55.1)
RPI_USB3_TX1_P: 05_RPi_mPCIe (J2.71), 13_Temp (IC55.2)
RPI_USB_D_N: 05_RPi_mPCIe (J2.3), 08_USB (IC20.2 R117.2)
RPI_USB_D_P: 05_RPi_mPCIe (J2.5), 08_USB (IC20.1 R116.2)
RPI_USB_OTG_ID: 05_RPi_mPCIe (J2.1), 08_USB (R103.1 R110.2)
RPI_VBAT: 05_RPi_mPCIe (J1.76), 07_Misc_2 (R78.1)
RPI_VBUS_EN: 05_RPi_mPCIe (IC1.1), 13_Temp (R271.2)
USB_HUB_D2_N: 08_USB (IC19#2.3), 13_Temp (IC52.5)
USB_HUB_D2_P: 08_USB (IC19#2.4), 13_Temp (IC52.4)
USB_HUB_D3_N: 08_USB (IC19#2.6), 13_Temp (IC53.5)
USB_HUB_D3_P: 08_USB (IC19#2.7), 13_Temp (IC53.4)
USB_HUB_OCS23: 08_USB (IC19#2.22 IC19#2.27), 13_Temp (R125.2)
USB_HUB_PRTPWR_23: 08_USB (IC19#2.26), 13_Temp (R122.2)